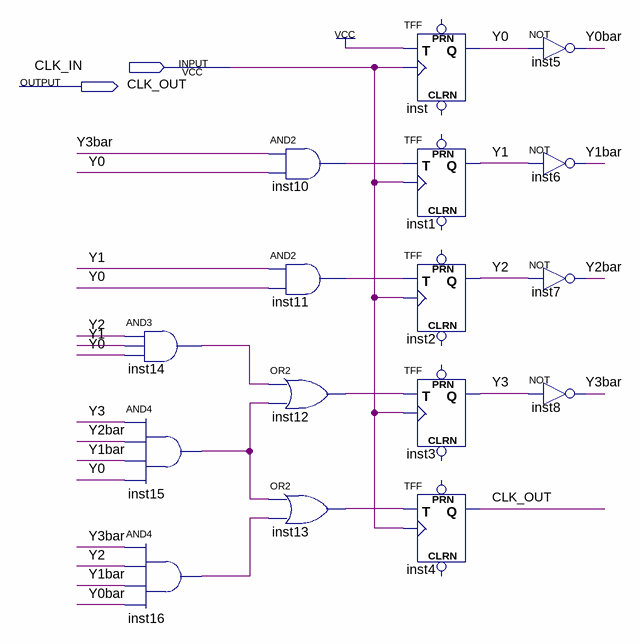
[diagram p0: schematic sheet]
// Quartus schematic div_clock.bdf as structural Verilog: 16 symbols, 2 pins
module div_clock (
  input  CLK_IN,
  output CLK_OUT
);

  wire inst10_out, inst11_out, inst12_out, inst13_out, inst14_out, inst15_out, inst16_out, Y0, Y0bar, Y1,
       Y1bar, Y2, Y2bar, Y3, Y3bar;

  and inst14 (inst14_out, Y2, Y1, Y0);
  and inst15 (inst15_out, Y3, Y2bar, Y1bar, Y0);
  and inst16 (inst16_out, Y3bar, Y2, Y1bar, Y0bar);
  and inst10 (inst10_out, Y3bar, Y0);
  and inst11 (inst11_out, Y1, Y0);
  or inst12 (inst12_out, inst14_out, inst15_out);
  or inst13 (inst13_out, inst15_out, inst16_out);
  TFF inst (.T(1'b1), .CLK(CLK_IN), .Q(Y0));  // open: PRN, CLRN
  TFF inst1 (.T(inst10_out), .CLK(CLK_IN), .Q(Y1));  // open: PRN, CLRN
  TFF inst2 (.T(inst11_out), .CLK(CLK_IN), .Q(Y2));  // open: PRN, CLRN
  TFF inst3 (.T(inst12_out), .CLK(CLK_IN), .Q(Y3));  // open: PRN, CLRN
  TFF inst4 (.T(inst13_out), .CLK(CLK_IN), .Q(CLK_OUT));  // open: PRN, CLRN
  not inst5 (Y0bar, Y0);
  not inst6 (Y1bar, Y1);
  not inst7 (Y2bar, Y2);
  not inst8 (Y3bar, Y3);
endmodule
